# Altium schematic sheet 3.3V Power Supply.SchDoc: 3.3V Power Supply
size Letter
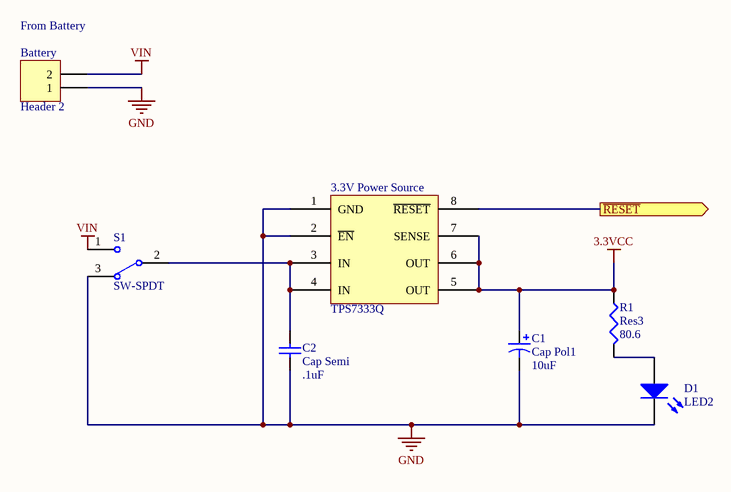
[diagram p0: 3.3V Power Supply.SchDoc]

## Parts
3.3V_Power_Source  TPS7333Q  [SOIC127P600-8BN]
Battery  Header 2  [HDR1X2]
C1  Cap Pol1  value 10uF  [TC7343-2917]
C2  Cap Semi  value .1uF  [CAPC2012N]
D1  LED2  [RESC3216N]
R1  Res3  value 80.6  [RESC2012N]
S1  SW-SPDT  [563-1102-1-ND]

## Ports
~{RESET} (out)

## Nets
3.3VCC: 3.3V_Power_Source.5(OUT) 3.3V_Power_Source.6(OUT) 3.3V_Power_Source.7(SENSE) C1.1 R1.1
GND: 3.3V_Power_Source.1(GND) 3.3V_Power_Source.2(~{EN}) Battery.1 C1.2 C2.1 D1.2(K) S1.3
VIN: Battery.2 S1.1
~{RESET}: 3.3V_Power_Source.8(~{RESET}) ; port ~{RESET}
Net3.3V_Power_Source_3: 3.3V_Power_Source.3(IN) 3.3V_Power_Source.4(IN) C2.2 S1.2
NetD1_1: D1.1(A) R1.2

## Notes on the sheet
- (near Battery) From Battery
- Title
- Size:
- Date:
- Letter
- Number:
- Time:
- Revision:
- Sheet
- of
- File:

## Library data of the parts
Battery = Header 2: Header, 2-Pin; LatestRevisionDate: 17-Jul-2002; LatestRevisionNote: Re-released for DXP Platform.; Publisher: Altium Limited
C1 = Cap Pol1: Polarized Capacitor (Radial); Published: 8-Jun-2000; LatestRevisionDate: 17-Jul-2002; LatestRevisionNote: Re-released for DXP Platform.; PackageReference: RB7.6-15; Publisher: Altium Limited; PackageDescription: Polarized Capacitor (Radial); 2 Leads
C2 = Cap Semi: Capacitor (Semiconductor SIM Model); Published: 8-Jun-2000; LatestRevisionDate: 29-May-2009; LatestRevisionNote: IPC-7351 Footprint Added.; PackageReference: C1206; Publisher: Altium Limited; PackageDescription: Chip Capacitor
D1 = LED2: Typical RED, GREEN, YELLOW, AMBER GaAs LED; Published: 8-Jun-2000; LatestRevisionDate: 17-Jul-2002; LatestRevisionNote: Re-released for DXP Platform.; PackageVersion: Feb-2002; PackageReference: 3.2X1.6X1.1; Publisher: Altium Limited; PackageDescription: SM LED; 2 Flat Leads
R1 = Res3: Resistor; Published: 8-Jun-2000; LatestRevisionDate: 29-May-2009; LatestRevisionNote: IPC-7351 Footprint Added.; PackageReference: J1-0603; Publisher: Altium Limited; PackageDescription: Chip Resistor
S1 = SW-SPDT: SPDT Subminiature Toggle Switch, Right Angle Mounting, Vertical Actuation; Published: 24-Mar-1999; LatestRevisionDate: 17-Dec-2003; LatestRevisionNote: Schematic revised, PCB Footprint replaced.; DatasheetVersion: 05-Dec-2000; PackageReference: TL36WW15050; Publisher: Altium Limited; PackageDescription: Switch; 4 Leads; ComponentLink1Description: Manufacturer Link; ComponentLink1URL: http://www.apem.com